# EAGLE schematic Lora Shield v1.2 (EAGLE 6.6.0)

## Sheet 1 of 2
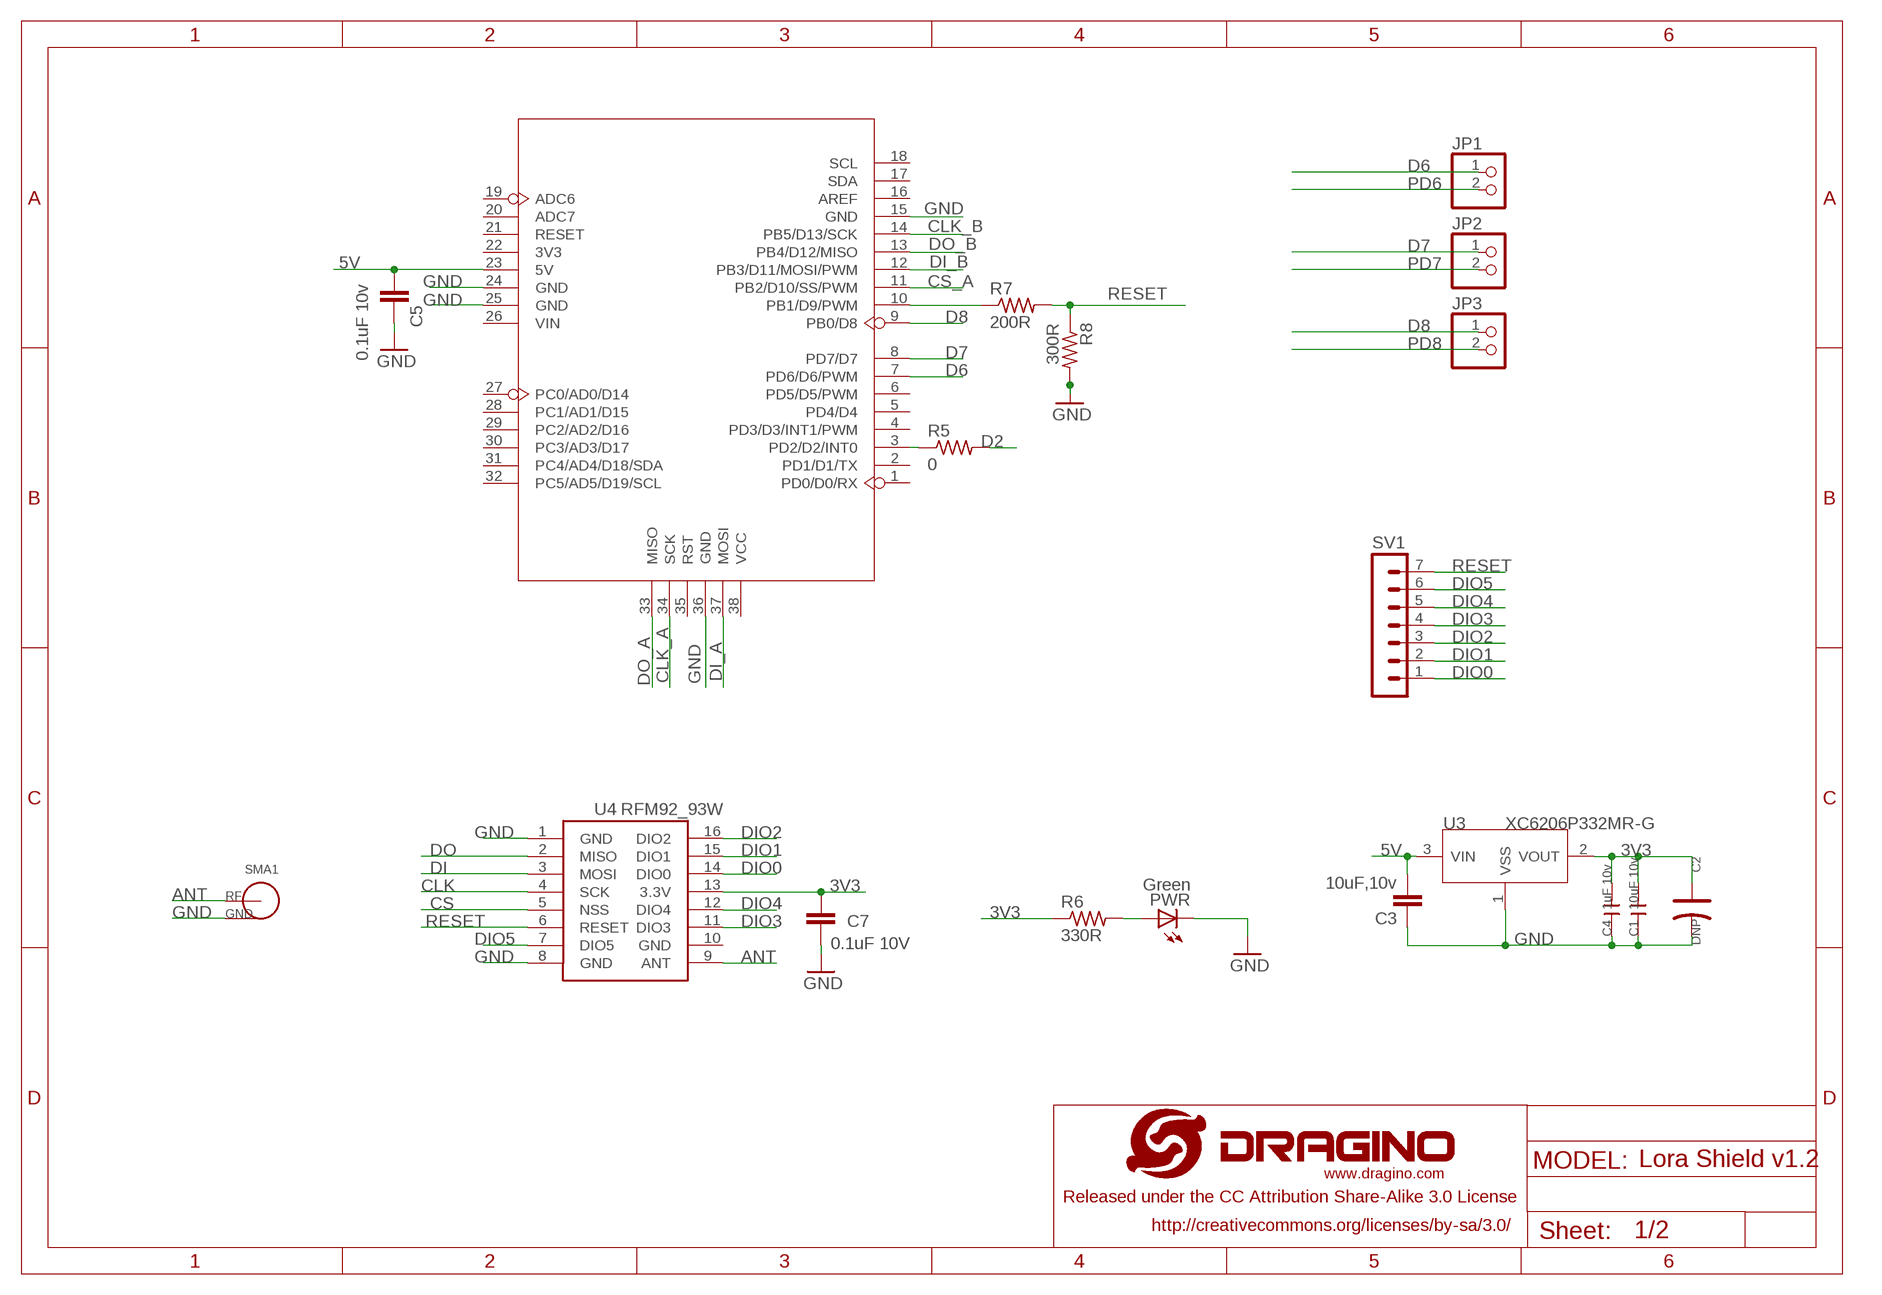
[diagram p0: schematic, sheet 1]

### Parts
C1  10uF 10v  C-0805  [C0805]
C2  DNP  CAP-AVX-A  [AVX-A]
C3  10uF,10v  C-EUC0805  [C0805]
C4  1uF 10v  C-0805  [C0805]
C5  0.1uF 10v  C-EUC0805  [C0805]
C7  0.1uF 10V  C-EUC0402  [C0402]
JP1  PINHD-1X2  [1X02]
JP2  PINHD-1X2  [1X02]
JP3  PINHD-1X2  [1X02]
PWR  Green  LEDCHIP-LED0603  [CHIP-LED0603]
R5  0  R-US_R0603  [R0603]
R6  330R  R-US_R0402  [R0402]
R7  200R  R-US_R0402  [R0402]
R8  300R  R-US_R0402  [R0402]
SMA1  SMA-KWE  [SMA-KWE]
SV1  MA07-1  [MA07-1]
U3  XC6206P332MR-G  XC6206MR  [SOT23]
U4  RFM92_93W  [RFM92_93W]
U5  MOUDLE_ARDUINO-38P328P_NO_VIA  [MOUDLE_ARDUINO-328P--]
U$1  LOGO-NEW  [LOGO-SILK-NEW]

### Nets
3V3: C1.2 C2.+ C4.2 C7.2 R6.1 U3.2(VOUT) U4.13(3.3V) ; also sheet 2
5V: C3.2 C5.2 U3.3(VIN) U5.23(5V)
ANT: SMA1.1(SIG) U4.9(ANT)
CLK: U4.4(SCK) ; also sheet 2
CLK_A: U5.34(SCK) ; also sheet 2
CLK_B: U5.14(PB5/D13/SCK) ; also sheet 2
CS: U4.5(NSS) ; also sheet 2
CS_A: U5.11(PB2/D10/SS/PWM) ; also sheet 2
D2: R5.2 ; also sheet 2
D6: JP1.1 U5.7(PD6/D6/PWM)
D7: JP2.1 U5.8(PD7/D7)
D8: JP3.1 U5.9(PB0/D8)
DI: U4.3(MOSI) ; also sheet 2
DI_A: U5.37(MOSI) ; also sheet 2
DI_B: U5.12(PB3/D11/MOSI/PWM) ; also sheet 2
DIO0: SV1.1 U4.14(DIO0) ; also sheet 2
DIO1: SV1.2 U4.15(DIO1) ; also sheet 2
DIO2: SV1.3 U4.16(DIO2) ; also sheet 2
DIO3: SV1.4 U4.11(DIO3)
DIO4: SV1.5 U4.12(DIO4)
DIO5: SV1.6 U4.7(DIO5) ; also sheet 2
DO: U4.2(MISO) ; also sheet 2
DO_A: U5.33(MISO) ; also sheet 2
DO_B: U5.13(PB4/D12/MISO) ; also sheet 2
GND: C1.1 C2.- C3.1 C4.1 C5.1 C7.1 PWR.C R8.2 SMA1.2(GND) SMA1.3(GND) SMA1.4(GND) SMA1.5(GND) U3.1(VSS) U4.1(GND) U4.8(GND) U5.15(GND) U5.24(GND) U5.25(GND) U5.36(GND) ; also sheet 2
N$1: R5.1 U5.3(PD2/D2/INT0)
N$6: PWR.A R6.2
N$7: R7.1 U5.10(PB1/D9/PWM)
PD6: JP1.2 ; also sheet 2
PD7: JP2.2 ; also sheet 2
PD8: JP3.2 ; also sheet 2
RESET: R7.2 R8.1 SV1.7 U4.6(RESET)
Unconnected: U5.1(PD0/D0/RX) U5.2(PD1/D1/TX) U5.4(PD3/D3/INT1/PWM) U5.5(PD4/D4) U5.6(PD5/D5/PWM) U5.16(AREF) U5.17(SDA) U5.18(SCL) U5.19(ADC6) U5.20(ADC7) U5.21(RESET) U5.22(3V3) U5.26(VIN) U5.27(PC0/AD0/D14) U5.28(PC1/AD1/D15) U5.29(PC2/AD2/D16) U5.30(PC3/AD3/D17) U5.31(PC4/AD4/D18/SDA) U5.32(PC5/AD5/D19/SCL) U5.35(RST) U5.38(VCC)

## Sheet 2 of 2
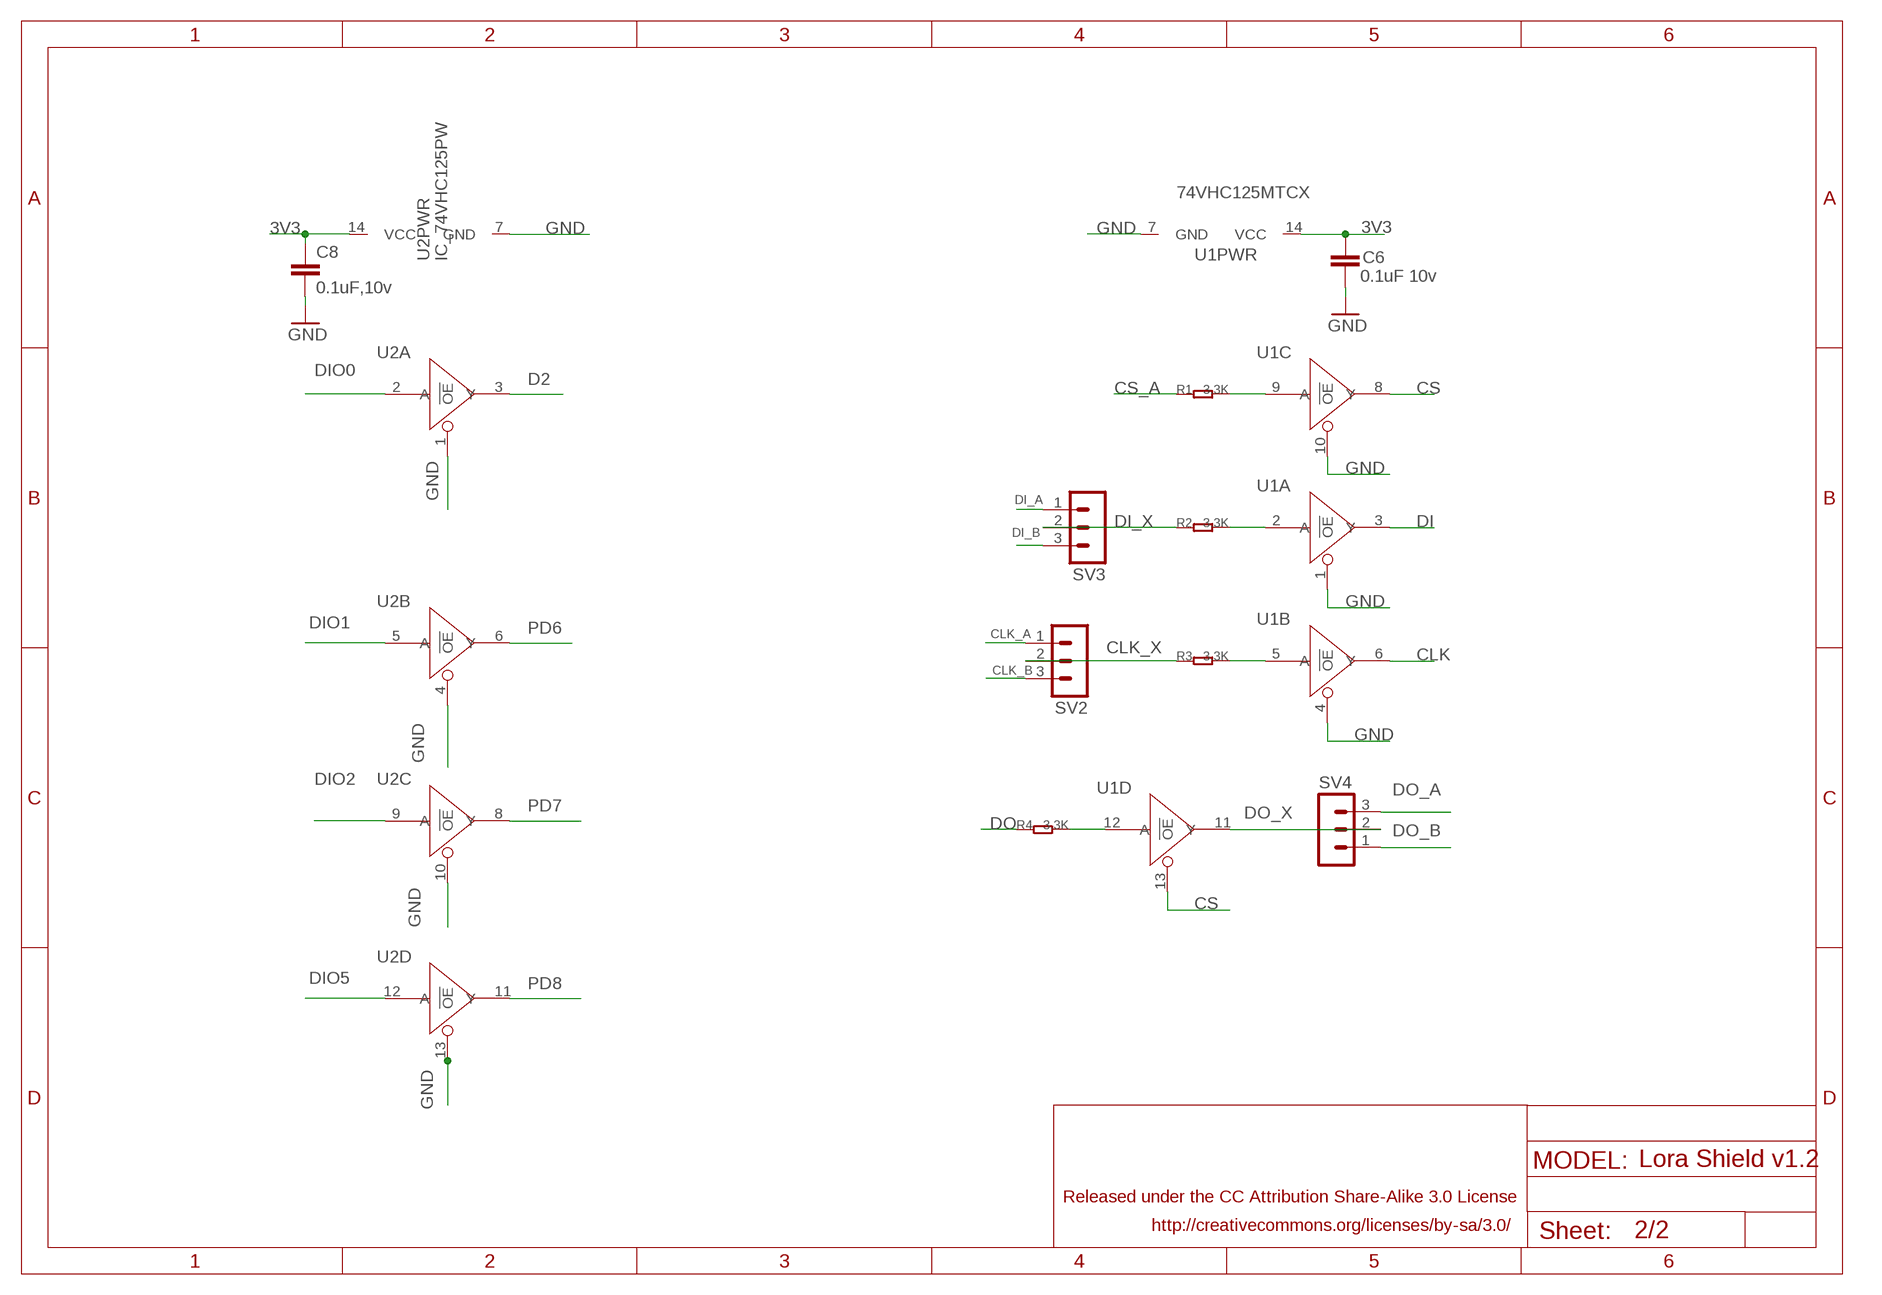
[diagram p1: schematic, sheet 2]

### Parts
C6  0.1uF 10v  C-EUC0805  [C0805]
C8  0.1uF,10v  C-EUC0805  [C0805]
R1  3.3K  R-0603  [R0603]
R2  3.3K  R-0603  [R0603]
R3  3.3K  R-0603  [R0603]
R4  3.3K  R-0603  [R0603]
SV2  MA03-1  [MA03-1]
SV3  MA03-1  [MA03-1]
SV4  MA03-1  [MA03-1]
U1  74VHC125MTCX  74VHC125PW  [TSSOP14]
U2  IC_74VHC125PW  [IC_TSSOP14]

### Nets
3V3: C6.2 C8.1 U1.14(PWR:VCC) U2.14(PWR:VCC) ; also sheet 1
CLK: U1.6(B:Y) ; also sheet 1
CLK_A: SV2.1 ; also sheet 1
CLK_B: SV2.3 ; also sheet 1
CLK_X: R3.1 SV2.2
CS: U1.8(C:Y) U1.13(D:!OE) ; also sheet 1
CS_A: R1.1 ; also sheet 1
D2: U2.3(A:Y) ; also sheet 1
DI: U1.3(A:Y) ; also sheet 1
DI_A: SV3.1 ; also sheet 1
DI_B: SV3.3 ; also sheet 1
DI_X: R2.1 SV3.2
DIO0: U2.2(A:A) ; also sheet 1
DIO1: U2.5(B:A) ; also sheet 1
DIO2: U2.9(C:A) ; also sheet 1
DIO5: U2.12(D:A) ; also sheet 1
DO: R4.1 ; also sheet 1
DO_A: SV4.3 ; also sheet 1
DO_B: SV4.1 ; also sheet 1
DO_X: SV4.2 U1.11(D:Y)
GND: C6.1 C8.2 U1.1(A:!OE) U1.4(B:!OE) U1.7(PWR:GND) U1.10(C:!OE) U2.1(A:!OE) U2.4(B:!OE) U2.7(PWR:GND) U2.10(C:!OE) U2.13(D:!OE) ; also sheet 1
N$2: R4.2 U1.12(D:A)
N$3: R3.2 U1.5(B:A)
N$4: R2.2 U1.2(A:A)
N$5: R1.2 U1.9(C:A)
PD6: U2.6(B:Y) ; also sheet 1
PD7: U2.8(C:Y) ; also sheet 1
PD8: U2.11(D:Y) ; also sheet 1

## Power pins joined to a net without a drawn wire
GND: U4.10(GND)

## Library data of the parts
C1 C4 = Discrete:C*: Ceramic Capacitors
C2 = Discrete:CAP*: Electrolytic Capacitors,Tantalum Capacitors and Super Capacitors
C3 C6-C8 = dragino-passive:C-EU: CAPACITOR, European symbol
C5 = resistor:C-EU: CAPACITOR, European symbol
JP1-JP3 = pinhead:PINHD-1X2: PIN HEADER
PWR = dragino:LED: LED OSRAM: - CHIPLED LG R971, LG N971, LY N971, LG Q971, LY Q971, LO R971, LY R971 LH N974, LH R974 LS Q976, LO Q976, LY Q976 LO Q996 - Hyper CHIPLED LW Q18S LB Q993, LB Q99A, LB R99A - SideLED LS A670, LO A670, LY A670, LG A670, LP A670 LB A673, LV A673, LT A673, LW A673 LH A674 LY A675 LS A676, LA A676, LO A676, LY A676, LW A676 LS A679, LY A679, LG A679 - Hyper Micro SIDELED® LS Y876, LA Y876, LO Y876, LY Y876 LT Y87S - SmartLED LW L88C, LW L88S LB L89C, LB L89S, LG L890 LS L89K, LO L89K, LY L89K LS L896, LA L896, LO L896, LY L896 - TOPLED LS T670, LO T670, LY T670, LG T670, LP T670 LSG T670, LSP T670, LSY T670, LOP T670, LYG T670 LG T671, LOG T671, LSG T671 LB T673, LV T673, LT T673, LW T673 LH T674 LS T676, LA T676, LO T676, LY T676, LB T676, LH T676, LSB T676, LW T676 LB T67C, LV T67C, LT T67C, LS T67K, LO T67K, LY T67K, LW E67C LS E67B, LA E67B, LO E67B, LY E67B, LB E67C, LV E67C, LT E67C LW T67C LS T679, LY T679, LG T679 LS T770, LO T770, LY T770, LG T770, LP T770 LB T773, LV T773, LT T773, LW T773 LH T774 LS E675, LA E675, LY E675, LS T675 LS T776, LA T776, LO T776, LY T776, LB T776 LHGB T686 LT T68C, LB T68C - Hyper Mini TOPLED® LB M676 - Mini TOPLED Santana® LG M470 LS M47K, LO M47K, LY M47K Source: http://www.osram.convergy.de LUXEON: - LUMILED® LXK2-PW12-R00, LXK2-PW12-S00, LXK2-PW14-U00, LXK2-PW14-V00 LXK2-PM12-R00, LXK2-PM12-S00, LXK2-PM14-U00 LXK2-PE12-Q00, LXK2-PE12-R00, LXK2-PE12-S00, LXK2-PE14-T00, LXK2-PE14-U00 LXK2-PB12-K00, LXK2-PB12-L00, LXK2-PB12-M00, LXK2-PB14-N00, LXK2-PB14-P00, LXK2-PB14-Q00 LXK2-PR12-L00, LXK2-PR12-M00, LXK2-PR14-Q00, LXK2-PR14-R00 LXK2-PD12-Q00, LXK2-PD12-R00, LXK2-PD12-S00 LXK2-PH12-R00, LXK2-PH12-S00 LXK2-PL12-P00, LXK2-PL12-Q00, LXK2-PL12-R00 Source: www.luxeon.com KINGBRIGHT: KA-3528ASYC Source: www.kingbright.com
R1-R4 = Discrete:R*
R5 = resistor:R-US_: RESISTOR, American symbol
R6-R8 = dragino:R-US_: RESISTOR, American symbol
SMA1 = dragino:SMA-KWE
SV1 = con-lstb:MA07-1: PIN HEADER; OC_FARNELL: unknown; OC_NEWARK: unknown
SV2-SV4 = con-lstb:MA03-1: PIN HEADER; OC_FARNELL: unknown; OC_NEWARK: unknown
U1 = IC:74V*125: Quad Buffer/Line Driver;3-state
U2 = Lora Shield v1.1.1:IC_74V*125: Quad Buffer/Line Driver;3-state
U3 = IC:XC6206: LOW ESR Cap.Compatible Positive Voltage Regulators
U4 = dragino:RFM92_93W
U5 = board_arduino:MOUDLE_ARDUINO-38P
U$1 = dragino:LOGO-NEW

## Net classes
0 default: clearance 0.205 mm
2 gnd: width 0.305 mm, drill 0.305 mm, clearance 0.254 mm